# EAGLE design rc-light-controller-tlc5940-lpc812 (EAGLE 6.5.0)
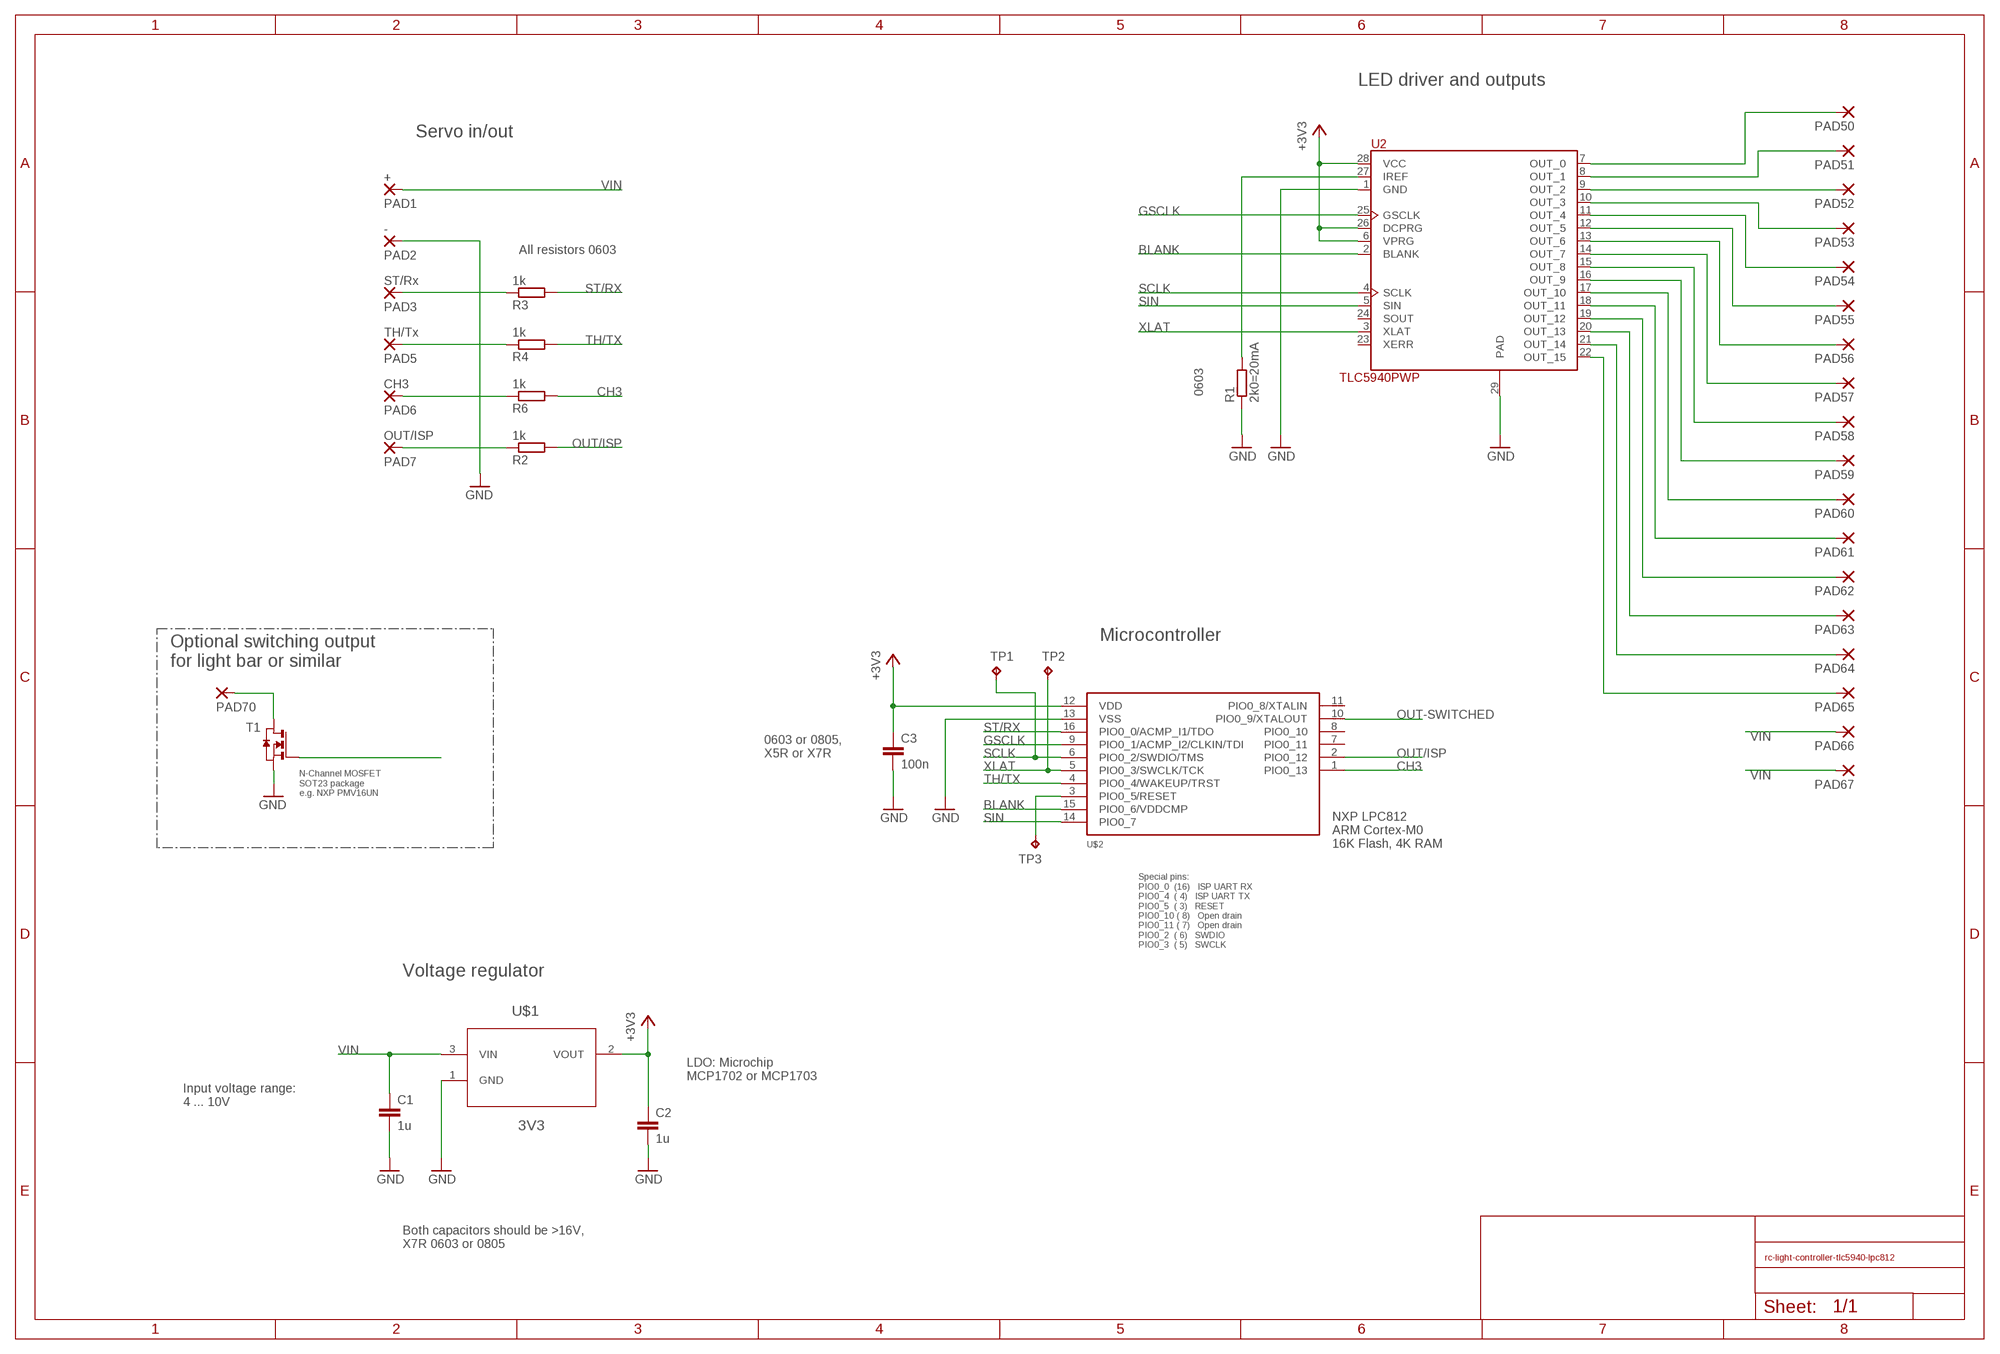
[diagram p0: schematic, sheet 1]

## Parts
C1  1u  C-EUC0805  [C0805]
C2  1u  C-EUC0805  [C0805]
C3  100n  C-EUC0805  [C0805]
PAD1  +  SDM80X120  [SMD80X120]
PAD2  -  SDM80X120  [SMD80X120]
PAD3  ST/Rx  SDM80X120  [SMD80X120]
PAD5  TH/Tx  SDM80X120  [SMD80X120]
PAD6  CH3  SDM80X120  [SMD80X120]
PAD7  OUT/ISP  SDM80X120  [SMD80X120]
PAD50  SMD50X100  [SMD50X100]
PAD51  SMD50X100  [SMD50X100]
PAD52  SMD50X100  [SMD50X100]
PAD53  SMD50X100  [SMD50X100]
PAD54  SMD50X100  [SMD50X100]
PAD55  SMD50X100  [SMD50X100]
PAD56  SMD50X100  [SMD50X100]
PAD57  SMD50X100  [SMD50X100]
PAD58  SMD50X100  [SMD50X100]
PAD59  SMD50X100  [SMD50X100]
PAD60  SMD50X100  [SMD50X100]
PAD61  SMD50X100  [SMD50X100]
PAD62  SMD50X100  [SMD50X100]
PAD63  SMD50X100  [SMD50X100]
PAD64  SMD50X100  [SMD50X100]
PAD65  SMD50X100  [SMD50X100]
PAD66  SMD50X100  [SMD50X100]
PAD67  SMD50X100  [SMD50X100]
PAD70  SMD50X100  [SMD50X100]
R1  2k0=20mA  R-EU_R0805  [R0805]
R2  1k  R-EU_R0603  [R0603]
R3  1k  R-EU_R0603  [R0603]
R4  1k  R-EU_R0603  [R0603]
R6  1k  R-EU_R0603  [R0603]
T1  NMOSSOT23  [SOT-23]
TP1  SWDIO  TPTP10R  [TP10R]
TP2  SWCLK  TPTP10R  [TP10R]
TP3  RESET  TPTP10R  [TP10R]
U2  TLC5940PWP  [SOP65P640X120-29N]
U$1  3V3  MCP1703T-3302E/CB  [SOT95P300X145-3N]
U$2  LPC812  LPC812M101JDH16  [TSSOP16]

## Nets
+3V3: C2.1 C3.1 U2.6(VPRG) U2.26(DCPRG) U2.28(VCC) U$1.2(VOUT) U$2.12(VDD)
BLANK: U2.2(BLANK) U$2.15(PIO0_6/VDDCMP)
CH3: R6.2 U$2.1(PIO0_13)
GND: C1.2 C2.2 C3.2 PAD2.1(P) R1.1 T1.2(S) U2.1(GND) U2.29(PAD) U$1.1(GND) U$2.13(VSS)
GSCLK: U2.25(GSCLK) U$2.9(PIO0_1/ACMP_I2/CLKIN/TDI)
IREF: R1.2 U2.27(IREF)
N$1: PAD6.1(P) R6.1
N$3: PAD70.1(P) T1.1(D)
N$4: TP3.TP U$2.3(PIO0_5/RESET)
N$5: PAD7.1(P) R2.1
N$17: PAD3.1(P) R3.1
N$18: PAD5.1(P) R4.1
OUT0: PAD50.1(P) U2.7(OUT_0)
OUT1: PAD51.1(P) U2.8(OUT_1)
OUT2: PAD52.1(P) U2.9(OUT_2)
OUT3: PAD53.1(P) U2.10(OUT_3)
OUT4: PAD54.1(P) U2.11(OUT_4)
OUT5: PAD55.1(P) U2.12(OUT_5)
OUT6: PAD56.1(P) U2.13(OUT_6)
OUT7: PAD57.1(P) U2.14(OUT_7)
OUT8: PAD58.1(P) U2.15(OUT_8)
OUT9: PAD59.1(P) U2.16(OUT_9)
OUT10: PAD60.1(P) U2.17(OUT_10)
OUT11: PAD61.1(P) U2.18(OUT_11)
OUT12: PAD62.1(P) U2.19(OUT_12)
OUT13: PAD63.1(P) U2.20(OUT_13)
OUT14: PAD64.1(P) U2.21(OUT_14)
OUT15: PAD65.1(P) U2.22(OUT_15)
OUT-SWITCHED: T1.3(G) U$2.10(PIO0_9/XTALOUT)
OUT/ISP: R2.2 U$2.2(PIO0_12)
SCLK: TP1.TP U2.4(SCLK) U$2.6(PIO0_2/SWDIO/TMS)
SIN: U2.5(SIN) U$2.14(PIO0_7)
ST/RX: R3.2 U$2.16(PIO0_0/ACMP_I1/TDO)
TH/TX: R4.2 U$2.4(PIO0_4/WAKEUP/TRST)
VIN: C1.1 PAD1.1(P) PAD66.1(P) PAD67.1(P) U$1.3(VIN)
XLAT: TP2.TP U2.3(XLAT) U$2.5(PIO0_3/SWCLK/TCK)
Unconnected: U2.23(XERR) U2.24(SOUT) U$2.7(PIO0_11) U$2.8(PIO0_10) U$2.11(PIO0_8/XTALIN)

## Notes on the sheet
- LED driver and outputs
- Servo in/out
- All resistors 0603
- 0603
- Microcontroller
- Optional switching output
  for light bar or similar
- 0603 or 0805,
  X5R or X7R
- N-Channel MOSFET
  SOT23 package
  e.g. NXP PMV16UN
- NXP LPC812
  ARM Cortex-M0
  16K Flash, 4K RAM
- Special pins:
  PIO0_0  (16)   ISP UART RX
  PIO0_4  ( 4)   ISP UART TX
  PIO0_5  ( 3)   RESET
  PIO0_10 ( 8)   Open drain
  PIO0_11 ( 7)   Open drain
  PIO0_2  ( 6)   SWDIO
  PIO0_3  ( 5)   SWCLK
- Voltage regulator
- LDO: Microchip 
  MCP1702 or MCP1703
- Input voltage range:
  4 ... 10V
- Both capacitors should be >16V, 
  X7R 0603 or 0805

## Library data of the parts
C1-C3 = rcl:C-EU: CAPACITOR, European symbol
PAD1-PAD3 PAD5-PAD7 = wirepad:SDM80X120
PAD50-PAD67 PAD70 = wirepad:SMD50X100: SMD PAD
R1-R4 R6 = rcl:R-EU_: RESISTOR, European symbol
T1 = zetex:NMOSSOT23: MOS FET; OC_FARNELL: unknown; OC_NEWARK: unknown
TP1-TP3 = testpad:TP: Test pad
U2 = tlc5940:TLC5940: 16 CHANNEL LED DRIVER WITH DOT CORRECTION AND GRAYSCALE PWM CONTROL; MPN: TLC5940PWP; PACKAGE: HTSSOP-28; SUPPLIER: Texas Instruments
U$1 = MCP1703:MCP1703T-3302E/CB: Low Quiescent Current LDO Regulator; MPN: MCP1703T-3302E/CB; OC_FARNELL: 1439518; OC_NEWARK: 40M0637; PACKAGE: SOT-3; SUPPLIER: Microchip
U$2 = LPC810:LPC812M101JDH16

## Board
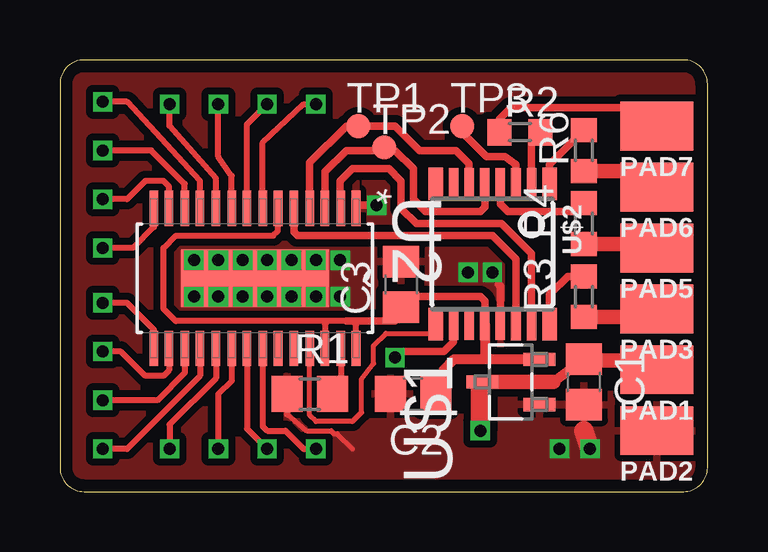
[diagram p1: board, top side]
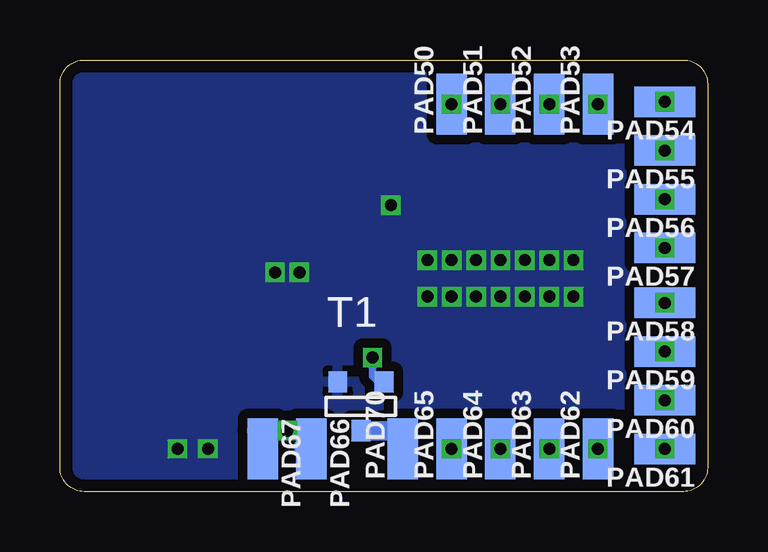
[diagram p2: board, bottom side, seen from below]

Size 27 x 18 mm. Coordinates in mm from the lower left corner, seen from the top.
Outline: 0,17 0,1 arc90 1,0 26,0 arc90 27,1 27,17 arc90 26,18 1,18 arc90 0,17
Copper layers (1*16): Top 0.035mm / dielectric 1.5mm / Bottom 0.035mm
Design rules "smart-prototyping": minimum track width 7mil, minimum drill 12mil, track to track 7mil, track to pad 7mil, pad to pad 7mil, via to via 7mil, smd to smd 0mil, copper to edge 20mil, drill to drill 10mil, minimum pad ring 10mil, minimum via ring 6mil, stop-mask expansion 2mil, vias tented up to drill 25mil, thermal gap 10mil

### Footprints (pad centres in the part's own frame; a part is rotated, then mirrored left to right if it is on the bottom)
C0805 = smd 1.3 x 1.5: 1 -0.95,0; 2 0.95,0
SMD80X120 = smd 2.032 x 3.048: 1 0,0
SMD50X100 = smd 1.27 x 2.54: 1 0,0
R0805 = smd 1.3 x 1.5: 1 -0.95,0; 2 0.95,0
R0603 = smd 1 x 1.1: 1 -0.85,0; 2 0.85,0
SOT-23 = smd 0.787 x 0.889: 1 0.025,-1.016; 2 -0.94,1.016; 3 0.991,1.016
TP10R = smd 1 x 1: TP 0,0
SOP65P640X120-29N = smd 1.473 x 0.356: 1 -2.921,4.216; 2 -2.921,3.581; 3 -2.921,2.921; 4 -2.921,2.286; 5 -2.921,1.626; 6 -2.921,0.965; 7 -2.921,0.33; 8 -2.921,-0.33; 9 -2.921,-0.965; 10 -2.921,-1.626; 11 -2.921,-2.286; 12 -2.921,-2.921; 13 -2.921,-3.581; 14 -2.921,-4.216; 15 2.921,-4.216; 16 2.921,-3.581; 17 2.921,-2.921; 18 2.921,-2.286; 19 2.921,-1.626; 20 2.921,-0.965; 21 2.921,-0.33; 22 2.921,0.33; 23 2.921,0.965; 24 2.921,1.626; 25 2.921,2.286; 26 2.921,2.921; 27 2.921,3.581; 28 2.921,4.216 | smd 2.388 x 6.172: 29 0,0
SOT95P300X145-3N = smd 0.559 x 1.321: 1 -0.94,-1.194; 2 0.94,-1.194; 3 0,1.194
TSSOP16 = smd 0.6 x 1.35: 1 -2.375,-2.925; 8 2.375,-2.925; 9 2.375,2.925; 16 -2.375,2.925 | smd 0.4 x 1.35: 2 -1.625,-2.918; 3 -0.975,-2.918; 4 -0.325,-2.918; 5 0.325,-2.918; 6 0.975,-2.918; 7 1.625,-2.918; 10 1.625,2.918; 11 0.975,2.918; 12 0.325,2.918; 13 -0.325,2.918; 14 -0.975,2.925; 15 -1.625,2.925

### Placement (x,y rotation side)
C1  21.84,4.57 270 top
C2  14.73,4.06 180 top
C3  14.22,8.64 90 top
PAD1  24.89,5.08 90 top
PAD2  24.89,2.54 90 top
PAD3  24.89,7.62 90 top
PAD5  24.89,10.16 90 top
PAD6  24.89,12.7 90 top
PAD7  24.89,15.24 90 top
PAD50  10.67,16.16 0 bottom
PAD51  8.64,16.16 0 bottom
PAD52  6.6,16.16 0 bottom
PAD53  4.57,16.16 0 bottom
PAD54  1.78,16.26 90 bottom
PAD55  1.78,14.22 90 bottom
PAD56  1.78,12.19 90 bottom
PAD57  1.78,10.16 90 bottom
PAD58  1.78,7.87 90 bottom
PAD59  1.78,5.84 90 bottom
PAD60  1.78,3.81 90 bottom
PAD61  1.78,1.78 90 bottom
PAD62  4.57,1.78 0 bottom
PAD63  6.6,1.78 0 bottom
PAD64  8.64,1.78 0 bottom
PAD65  10.67,1.78 0 bottom
PAD66  16.51,1.78 180 bottom
PAD67  18.55,1.78 180 bottom
PAD70  12.7,1.78 0 bottom
R1  10.41,4.06 0 top
R2  19.18,14.99 0 top
R3  21.84,8.13 90 top
R4  21.84,11.18 90 top
R6  21.84,14.22 90 top
T1  14.48,3.56 0 bottom
TP1  12.45,15.24 0 top
TP2  13.53,14.35 0 top
TP3  16.76,15.24 0 top
U2  8.13,8.89 270 top
U$1  18.8,4.57 90 top
U$2  18.03,9.91 180 top

### Tracks (layer width: path | path; a pad name or v marks a point on that pad's centre or on a via)
+3V3
  Top 0.254: U2.28 12.34,6.96 12.19,7.11 11.94,7.11 11.18,7.11 | 11.18,7.11 11.05,6.99 U2.26 | 11.18,7.11 4.83,7.11 4.32,7.62 4.32,10.16 4.83,10.67 8.89,10.67 9.09,10.87 U2.6
  Top 0.305: 17.71,5.58 17.78,5.51 | 16,4.38 C2.1 | 14.22,7.37 14.73,8.13 17.53,8.13 17.71,7.95 U$2.12 | 11.94,7.11 13.97,7.11 14.22,7.37 | 14.22,7.37 C3.1
  Top 0.406: U$1.2 17.78,5.51 16.43,5.51 16,5.08 16,4.38 | U$2.12 17.71,5.58
BLANK
  Top 0.305: U2.2 11.68,11.84 11.68,12.95 12.19,13.46 13.72,13.46 14.22,12.95 14.22,11.81 14.86,11.18 18.41,11.18 19.66,9.93 U$2.15
CH3
  Top 0.305: U$2.1 20.41,13.64 R6.2
GND  (via drill 0.5)
  Top 0.203: 9.46,3.24 10.29,2.54 11.3,2.54 11.43,2.41 11.56,2.41 12.19,1.78
  Top 0.254: R1.1 9.46,3.24
  Top 0.305: U2.1 12.47,11.94 v13.21,11.94 | v7.62,8.13 8.13,8.64 U2.29 | U$2.13 18.36,8.56 18.29,8.64
  Top 0.406: 21.83,3.63 C1.2
  Top 0.813: v22.1,1.78 21.84,2.54
  other vias: 8.64,9.65 9.65,9.65 5.59,9.65 6.6,9.65 7.62,9.65 10.67,9.65 10.67,8.13 9.65,8.13 8.64,8.13 6.6,8.13 5.59,8.13 20.83,1.78 11.68,9.65 11.68,8.13 17.02,9.14 18.03,9.14
  pour Bottom (isolate 0.406): 0,18 27,18 27,0 0,0
  pour Top (isolate 0.305): 0,18 27,18 27,0 0,0
GSCLK
  Top 0.203: U2.25 10.41,3.17 10.67,2.92 12.19,2.92 12.57,3.3 12.57,4.7 13.08,5.33 13.08,6.1 13.59,6.6 15.66,6.6 U$2.9
IREF
  Top 0.254: U2.27 11.71,4.11 R1.2
N$1
  Top 0.61: R6.1 24.47,13.37 PAD6.1
N$3
  Bottom 0.813: T1.1 12.7,2.54 PAD70.1
N$4
  Top 0.305: U$2.3 19.01,13.63 18.54,13.97 17.78,13.97 16.76,14.99 TP3.TP
N$5
  Top 0.305: PAD7.1 24.13,16 18.8,16 18.33,15.53 R2.1
N$17
  Top 0.406: 24.04,7.02 24.26,7.24 | 24.26,7.24 PAD3.1 | 24.22,7.28 24.26,7.24
  Top 0.61: R3.1 24.22,7.28
N$18
  Top 0.406: R4.1 22.19,10.41
  Top 0.61: PAD5.1 24.73,10.33 R4.1
OUT0  (via drill 0.5)
  Top 0.254: U2.7 8.46,14.55 10.16,16.16 PAD50.1
  other vias: 10.67,16.16
OUT1  (via drill 0.5)
  Top 0.254: U2.8 7.8,15.32 PAD51.1
  other vias: 8.64,16.16
OUT2  (via drill 0.5)
  Top 0.254: U2.9 7.16,13.16 6.6,13.97 PAD52.1
  other vias: 6.6,16.16
OUT3  (via drill 0.5)
  Top 0.254: U2.10 6.5,13.06 4.57,15.24 PAD53.1
  other vias: 4.57,16.16
OUT4  (via drill 0.5)
  Top 0.254: U2.11 5.84,12.95 2.79,16.26 PAD54.1
  other vias: 1.78,16.26
OUT5  (via drill 0.5)
  Top 0.254: U2.12 5.21,12.83 3.81,14.22 PAD55.1
  other vias: 1.78,14.22
OUT6  (via drill 0.5)
  Top 0.254: U2.13 4.55,12.72 4.32,12.95 3.56,12.95 2.79,12.19 PAD56.1
  other vias: 1.78,12.19
OUT7  (via drill 0.5)
  Top 0.254: U2.14 3.91,11.02 3.05,10.16 PAD57.1
  other vias: 1.78,10.16
OUT8  (via drill 0.5)
  Top 0.254: U2.15 3.91,6.76 2.79,7.87 PAD58.1
  other vias: 1.78,7.87
OUT9  (via drill 0.5)
  Top 0.254: U2.16 4.55,5.05 4.32,4.83 3.56,4.83 2.54,5.84 PAD59.1
  other vias: 1.78,5.84
OUT10  (via drill 0.5)
  Top 0.254: U2.17 5.21,4.95 4.06,3.81 PAD60.1
  other vias: 1.78,3.81
OUT11  (via drill 0.5)
  Top 0.254: U2.18 5.84,4.83 2.79,1.78 PAD61.1
  other vias: 1.78,1.78
OUT12  (via drill 0.5)
  Top 0.254: U2.19 6.5,4.72 4.57,2.79 PAD62.1
  other vias: 4.57,1.78
OUT13  (via drill 0.5)
  Top 0.254: U2.20 7.16,4.62 6.6,4.06 PAD63.1
  other vias: 6.6,1.78
OUT14  (via drill 0.5)
  Top 0.254: U2.21 7.8,2.62 PAD64.1
  other vias: 8.64,1.78
OUT15  (via drill 0.5)
  Top 0.254: U2.22 8.46,2.72 8.64,2.54 9.4,2.54 10.16,1.78 PAD65.1
  other vias: 10.67,1.78
OUT-SWITCHED  (via drill 0.5)
  Top 0.305: U$2.10 16.41,6.25 16,5.84 14.22,5.84 v13.97,5.59
  Bottom 0.305: v13.97,5.59 13.97,4.83 13.72,4.57 T1.3
OUT/ISP
  Top 0.305: U$2.2 19.66,14.62 R2.2
SCLK
  Top 0.305: U2.4 10.41,13.72 11.94,15.24 TP1.TP 13.97,15.24 14.99,14.22 16.51,14.22 17.06,13.68 U$2.6
SIN
  Top 0.305: U2.5 9.75,10.82 9.91,10.67 18.03,10.67 19.01,9.69 U$2.14
ST/RX
  Top 0.305: U$2.16 20.41,8.22 21.17,8.98 R3.2
TH/TX
  Top 0.305: U$2.4 18.36,11.99 18.67,11.68 21.5,11.68 R4.2
VIN  (via drill 0.5)
  Top 0.305: 21.46,5.46 21.78,5.78 C1.1 | 24,5.46 24.64,5.46 PAD1.1
  Top 0.406: 20.57,4.57 C1.1
  Top 0.61: 20.57,4.57 U$1.3 17.53,4.5 | 24,5.46 21.46,5.46
  Top 0.813: 17.53,4.5 v17.53,2.54
  Bottom 0.813: 16.85,1.86 16.76,1.86 PAD66.1 16.76,2.54 v17.53,2.54 18.8,2.54 PAD67.1
XLAT
  Top 0.305: 13.46,14.22 13.97,14.22 14.73,13.46 14.73,12.19 15.24,11.68 17.53,11.68 17.71,11.87 U$2.5 | 13.46,14.22 11.94,14.22 11.05,13.34 U2.3 | 13.46,14.22 13.27,14.16 13.4,14.16 TP2.TP

### Text on the board
tValues: . | .
bValues: 5 | 3 | 2 | 1 | 0 | 6 | LANE Boys RC | 7 | RC light controller | 8 | 9 | 10 | 12 | 13 | 14 | 15 | +LED | 4...10V